# Altium schematic sheet MotorDriver.SchDoc
size A
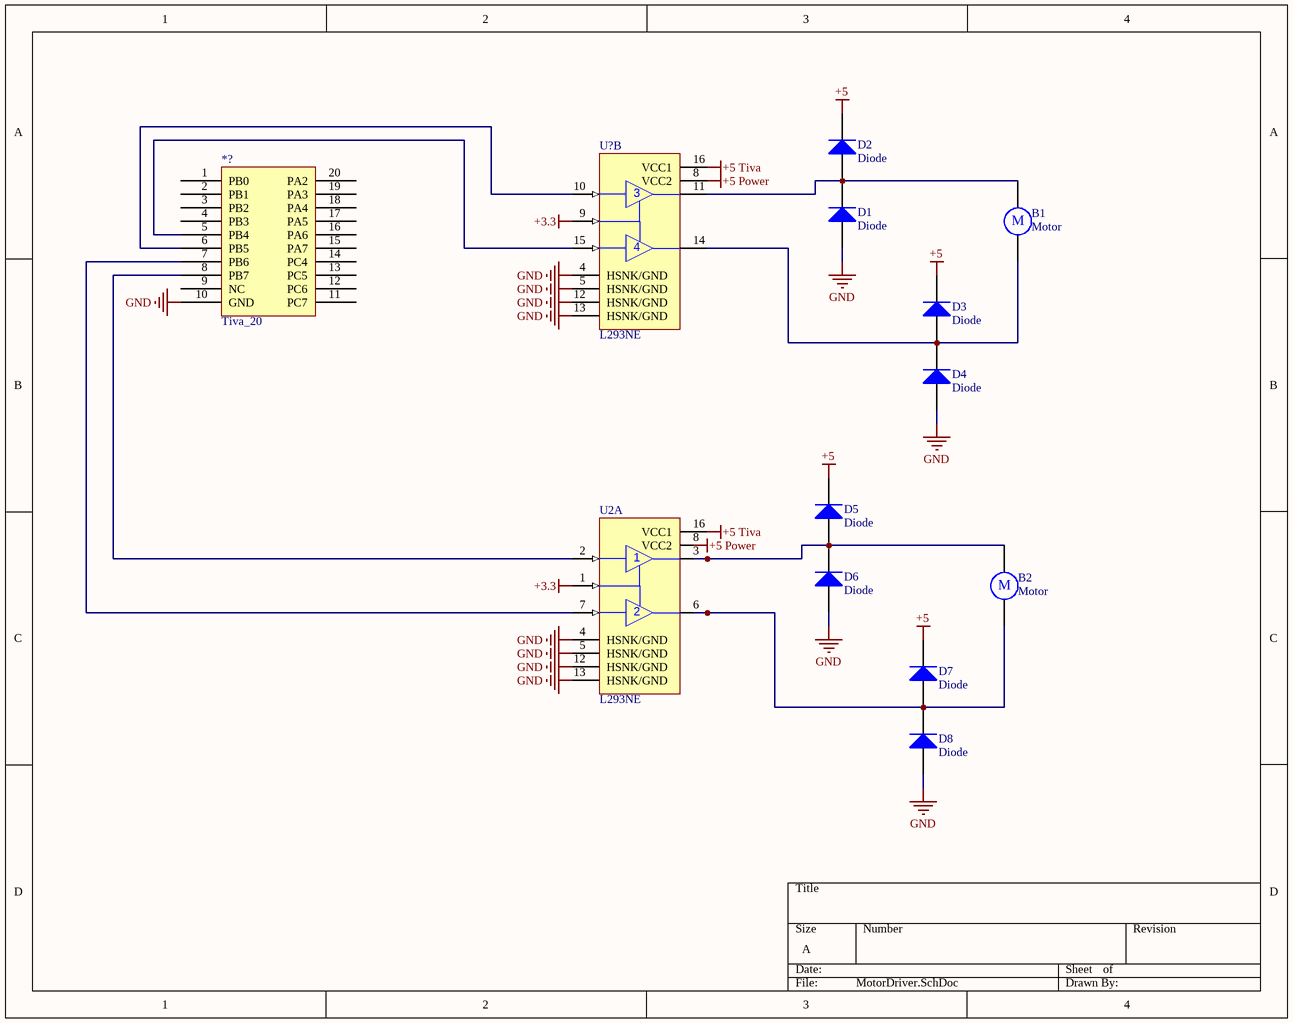
[diagram p0: MotorDriver.SchDoc]

## Parts
*?  Tiva_20
B1  Motor  [RB5-10.5]
B2  Motor  [RB5-10.5]
D1  Diode  [DSO-C2/X3.3]
D2  Diode  [DSO-C2/X3.3]
D3  Diode  [DSO-C2/X3.3]
D4  Diode  [DSO-C2/X3.3]
D5  Diode  [DSO-C2/X3.3]
D6  Diode  [DSO-C2/X3.3]
D7  Diode  [DSO-C2/X3.3]
D8  Diode  [DSO-C2/X3.3]
U2  L293NE  [DIP-16/X1.5]  (part A of 2)
U?  L293NE  [DIP-16/X1.5]  (part B of 2)

## Nets
+3.3: U2.1(1,2EN) U?.9(3,4EN)
+5: D2.2(K) D3.2(K) D5.2(K) D7.2(K)
+5 Power: U?.8(VCC2)
+5 Tiva: U2.16(VCC1) U?.16(VCC1)
GND: *?.10(GND) D1.1(A) D4.1(A) D6.1(A) D8.1(A) U2.4(HSNK/GND) U2.5(HSNK/GND) U2.12(HSNK/GND) U2.13(HSNK/GND) U?.4(HSNK/GND) U?.5(HSNK/GND) U?.12(HSNK/GND) U?.13(HSNK/GND)
Net*?_5: *?.5(PB4) U?.15(4A)
Net*?_6: *?.6(PB5) U?.10(3A)
Net*?_7: *?.7(PB6) U2.7(2A)
Net*?_8: *?.8(PB7) U2.2(1A)
NetB1_1: B1.1 D1.2(K) D2.1(A) U?.11(3Y)
NetB1_2: B1.2 D3.1(A) D4.2(K) U?.14(4Y)
NetB2_1: B2.1 D5.1(A) D6.2(K) U2.3(1Y)
NetB2_2: B2.2 D7.1(A) D8.2(K) U2.6(2Y)

Not connected (* = marked no-connect by the designer): *? 1(PB0) 2(PB1) 3(PB2) 4(PB3) 9(NC) 11(PC7) 12(PC6) 13(PC5) 14(PC4) 15(PA7) 16(PA6) 17(PA5) 18(PA4) 19(PA3) 20(PA2); U2 8(VCC2)

## Notes on the sheet
- Labels drawn without touching a wire or pin: +5 Power
- (in symbol Motor) M

## Library data of the parts
*? = Tiva_20: Tiva Protection 20 Pin Connector
B1 B2 = Motor: Motor, General Kind; Manufacturer: Generic Components; Published: 1999
D1-D8 = Diode: Default Diode; Manufacturer: Generic Components; Class: Discrete; SubClass: Diode - Switching; Published: 08/06/2000; Publisher: Altium Hobart Technology Centre
U2 U? = L293NE: Quadruple Half-H Driver; Manufacturer: Texas Instruments; Class: Interface; SubClass: Peripheral Driver; Published: 15/05/2002; Publisher: Altium Hobart Technology Centre